# Altium schematic sheet heater.SchDoc: Heater
size OrCAD A
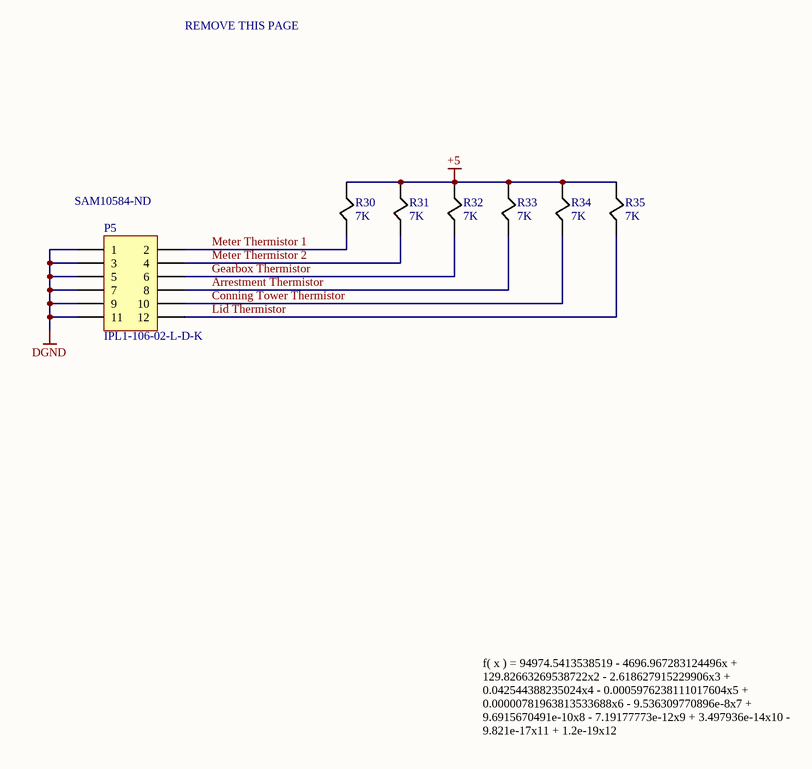
[diagram p0: heater.SchDoc]

## Parts
P5  IPL1-106-02-L-D-K  Supplier Part Number 1: SAM10584-ND
R30  7K  [0805]
R31  7K  [0805]
R32  7K  [0805]
R33  7K  [0805]
R34  7K  [0805]
R35  7K  [0805]

## Nets
+5: R30.2 R31.2 R32.2 R33.2 R34.2 R35.2
DGND: P5.1 P5.3 P5.5 P5.7 P5.9 P5.11
Arrestment Thermistor: P5.8 R33.1
Conning Tower Thermistor: P5.10 R34.1
Gearbox Thermistor: P5.6 R32.1
Lid Thermistor: P5.12 R35.1
Meter Thermistor 1: P5.2 R30.1
Meter Thermistor 2: P5.4 R31.1

## Notes on the sheet
- REMOVE THIS PAGE
- f( x ) = 94974.5413538519 - 4696.967283124496x + 129.82663269538722x2 - 2.618627915229906x3 + 0.042544388235024x4 - 0.0005976238111017604x5 + 0.00000781963813533688x6 - 9.536309770896e-8x7 + 9.6915670491e-10x8 - 7.19177773e-12x9 + 3.497936e-14x10 - 9.821e-17x11 + 1.2e-19x12
- Title
- Size:
- Date:
- Orcad A
- Number:
- Time:
- Revision:
- Sheet
- of
- ZLS Corporation
- 7801 North Lamar Blvd
- Suite E-184
- Austin, TX  78752
- Phone: (512) 453-0288
- File:

## Library data of the parts
P5 = Header 6X2: CONN SHROUDED PWR HEADER 12POS; Manufacturer 1: Samtec Inc.; Category 1: Connectors, Interconnects; Pitch - Mating: 0.100" (2.54mm); Style: Board to Cable/Wire; Shrouding: Shrouded - 4 Wall; Number of Positions: 12; Number of Positions Loaded: All; Contact Length - Mating: 0.215" (5.46mm); Material Flammability Rating: UL94 V-0; Voltage Rating: 675VAC, 954VDC; Supplier 1: Digi-Key; Manufacturer Part Number 1: IPL1-106-02-L-D-K; RoHS 1: RoHS Compliant; Description 1: CONN SHROUDED PWR HEADER 12POS; Stock 1: 100; Pricing 1: 1=3.53, 10=3.384, 25=3.102, 50=2.961, 100=2.82, 250=2.46752, 500=2.397, 1000=2.0445, 2500=1.9035 (USD); Packaging: Tube; Part Status: Active; Connector Type: Header; Contact Type: Male Pin; Number of Rows: 2; Row Spacing - Mating: 0.100" (2.54mm); Mounting Type: Surface Mount; Termination: Solder; Fastening Type: Locking Ramp; Contact Length - Post: -; Overall Contact Length: -; Insulation Height: 0.320" (8.13mm); Contact Shape: Square; Contact Finish - Mating: Gold; Contact Finish Thickness - Mating: 10µin (0.25µm); Contact Finish - Post: Tin; Contact Material: Phosphor Bronze; Insulation Material: Liquid Crystal Polymer (LCP); Features: -; Operating Temperature: -55°C ~ 125°C; Ingress Protection: -; Insulation Color: Natural; Current Rating: -; Mated Stacking Heights: -; Contact Finish Thickness - Post: -; Applications: -; ComponentLink1URL: http://suddendocs.samtec.com/prints/ipl1-1xx-xx-xxx-d-xx-x-xx-mkt.pdf; ComponentLink1Description: http://suddendocs.samtec.com/prints/ipl1-1xx-xx-xxx-d-xx-x-xx-mkt.pdf
R30-R35 = RES1: RES SMD 6.98K OHM 1% 1/8W 0805; Manufacturer 1: Vishay Dale; Manufacturer Part Number 1: CRCW08056K98FKEA; Category 1: Resistors; Power (Watts): 0.125W, 1/8W; Temperature Coefficient: ±100ppm/°C; Supplier 1: Digi-Key; Supplier Part Number 1: 541-6.98KCCT-ND; RoHS 1: RoHS Compliant; Description 1: RES SMD 6.98K OHM 1% 1/8W 0805; Stock 1: 39695; Pricing 1: 1=0.1, 10=0.042, 25=0.0304, 50=0.0232, 100=0.017, 250=0.013, 500=0.0104, 1000=0.00765 (USD); Packaging: Cut Tape (CT); Part Status: Active; Resistance (Ohms): 6.98k; Tolerance: ±1%; Composition: Thick Film; Features: Automotive AEC-Q200; Operating Temperature: -55°C ~ 155°C; Package / Case: 0805 (2012 Metric); Supplier Device Package: 0805; Size / Dimension: 0.079" L x 0.049" W (2.00mm x 1.25mm); Height - Seated (Max): 0.020" (0.50mm); Failure Rate: -; ComponentLink1URL: http://www.vishay.com/docs/20035/dcrcwe3.pdf; ComponentLink1Description: http://www.vishay.com/docs/20035/dcrcwe3.pdf